# Altium schematic sheet MOUTING.SchDoc
size 420 x 297 mm; SheetNumber: 32; SheetTotal: 33
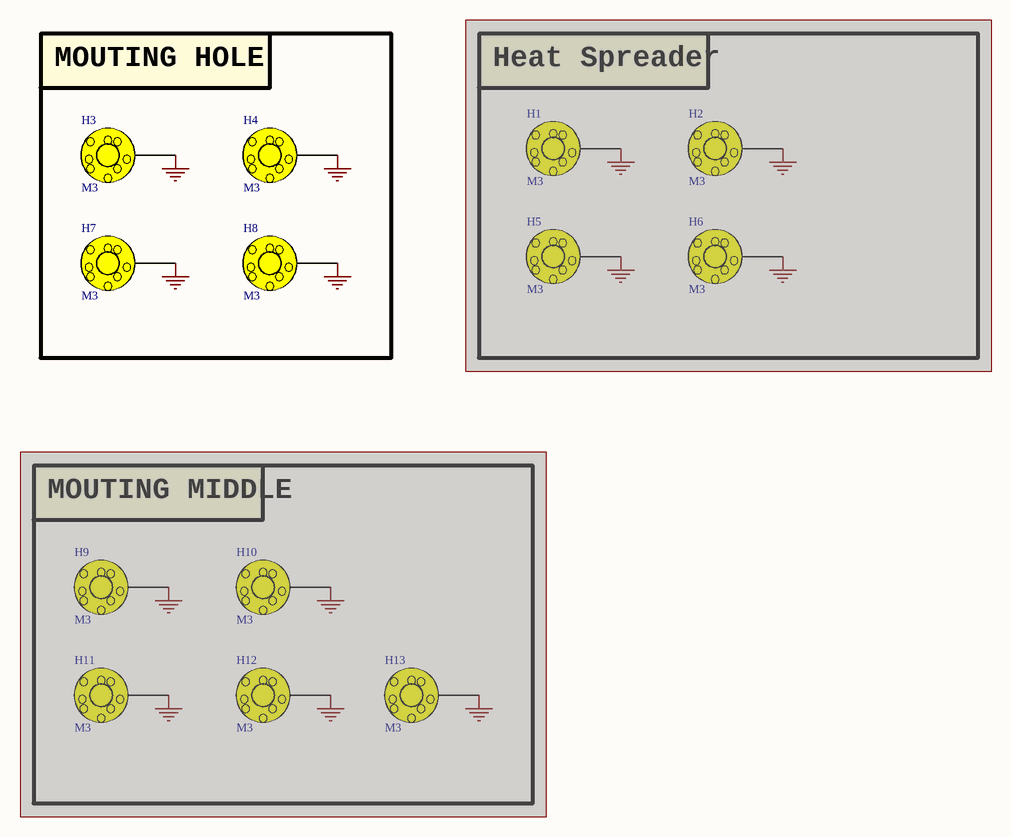
[diagram p0: MOUTING.SchDoc]

## Parts
H1  M3  [HEX-M3_NoVia]  (masked out: inside a compile mask, not in the netlist)
H2  M3  [HEX-M3_NoVia]  (masked out: inside a compile mask, not in the netlist)
H3  M3  [HEX-M3_NoVia]
H4  M3  [HEX-M3_NoVia]
H5  M3  [HEX-M3_NoVia]  (masked out: inside a compile mask, not in the netlist)
H6  M3  [HEX-M3_NoVia]  (masked out: inside a compile mask, not in the netlist)
H7  M3  [HEX-M3_NoVia]
H8  M3  [HEX-M3_NoVia]
H9  M3  [HEX-M3_NoVia]  (masked out: inside a compile mask, not in the netlist)
H10  M3  [HEX-M3_NoVia]  (masked out: inside a compile mask, not in the netlist)
H11  M3  [HEX-M3_NoVia]  (masked out: inside a compile mask, not in the netlist)
H12  M3  [HEX-M3_NoVia]  (masked out: inside a compile mask, not in the netlist)
H13  M3  [HEX-M3_NoVia]  (masked out: inside a compile mask, not in the netlist)

## Blocks framed on the sheet
MOUTING HOLE: H3 H4 H7 H8
Heat Spreader: H1 H2 H5 H6
MOUTING MIDDLE: H9-H13

## Nets
GND: H3.1 H4.1 H7.1 H8.1

## Notes on the sheet
- Project:
- BEE-1012
- Sub-system:
- SATELLITE_EXP_CONTROLLER
- Design by:
- SANG HUYNH
- BAO BUI
- Sheet title:
- Sheet
- A3
- of
- Checked by:
- Approved by:
- VU PHAM
- Revision:
- Document No:
- Size:
- Date:

## Library data of the parts
H1-H13 = HEX-M3